# Altium project PowerMonitor.PrjPcb
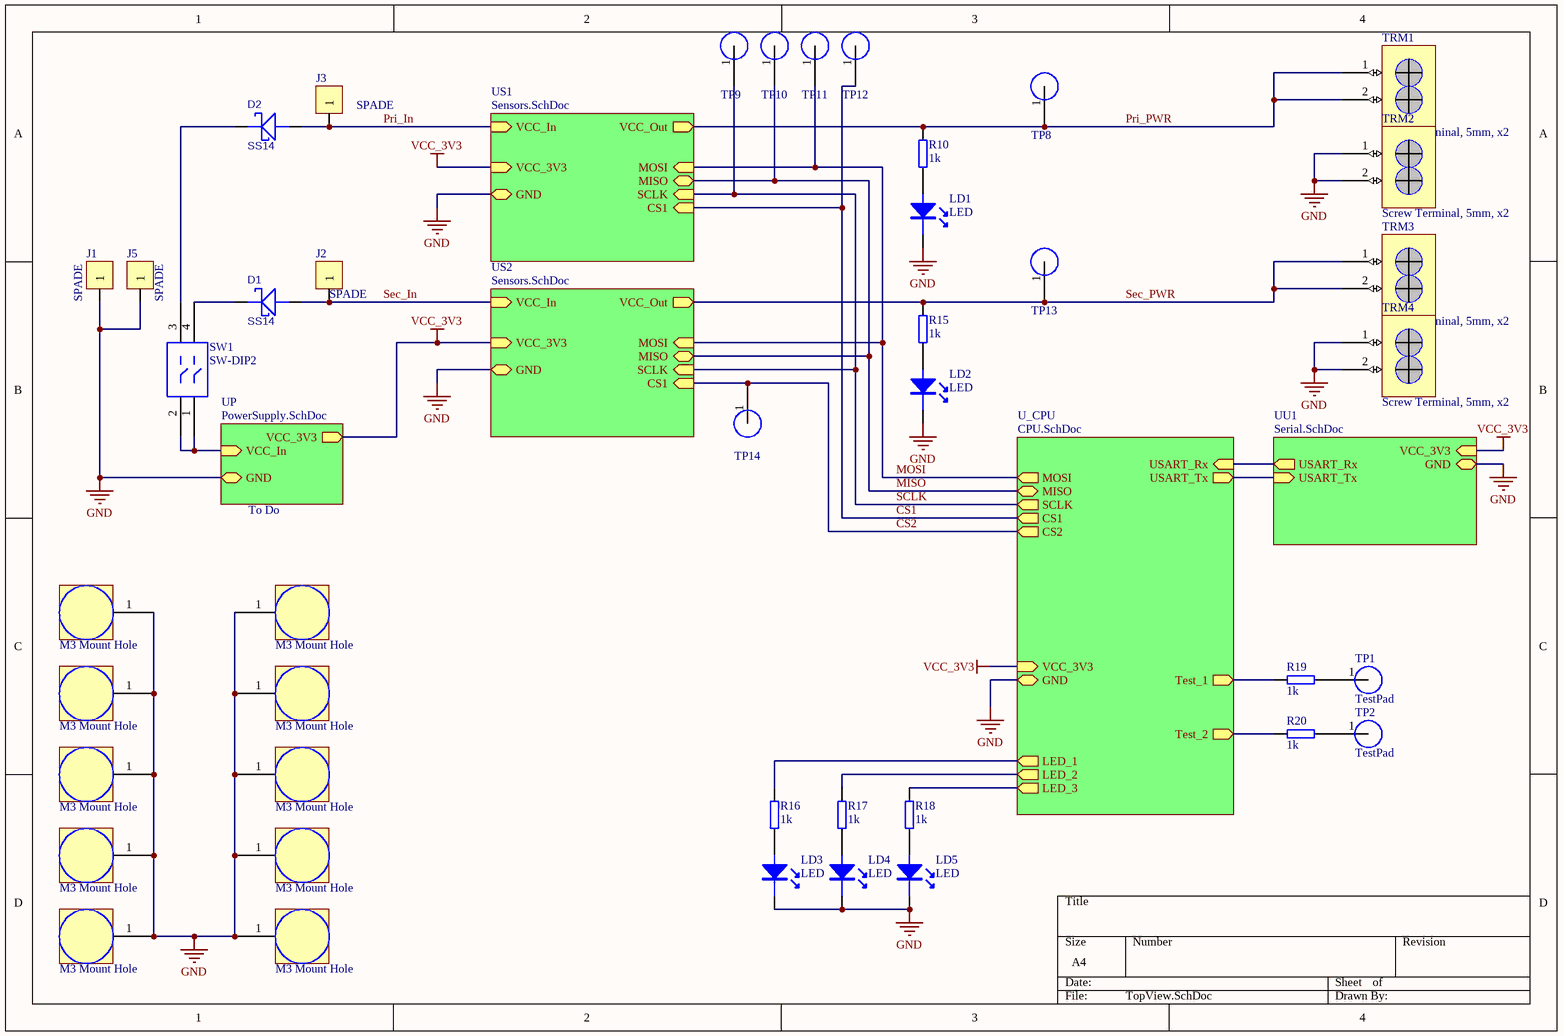
[diagram p0: TopView.SchDoc]
5 sheets, 138 parts. Net scope: hierarchical (ports join the sheet entries above them; power ports are global).
Board file: PowerMonito.PcbDoc
Sheets:
  TopView.SchDoc
    UP = PowerSupply.SchDoc
    US1 = Sensors.SchDoc
    US2 = Sensors.SchDoc
    UU1 = Serial.SchDoc
    U_CPU = CPU.SchDoc

## Sheet TopView.SchDoc
size A4

### Parts
D1  SS14  [DO-214AC]
D2  SS14  [DO-214AC]
J1  SPADE  [SPADE6.3-V]
J2  SPADE  [SPADE6.3-V]
J3  SPADE  [SPADE6.3-V]
J5  SPADE  [SPADE6.3-V]
LD1  LED  [LED3]
LD2  LED  [LED3]
LD3  LED  [LED3]
LD4  LED  [LED3]
LD5  LED  [LED3]
MNT1  M3 Mount Hole  [Mount_M3]
MNT2  M3 Mount Hole  [Mount_M3]
MNT3  M3 Mount Hole  [Mount_M3]
MNT4  M3 Mount Hole  [Mount_M3]
MNT5  M3 Mount Hole  [Mount_M3]
MNT6  M3 Mount Hole  [Mount_M3]
MNT7  M3 Mount Hole  [Mount_M3]
MNT8  M3 Mount Hole  [Mount_M3]
MNT9  M3 Mount Hole  [Mount_M3]
MNT10  M3 Mount Hole  [Mount_M3]
R10  1k  [0603]
R15  1k  [0603]
R16  1k  [0603]
R17  1k  [0603]
R18  1k  [0603]
R19  1k  [0603]
R20  1k  [0603]
SW1  SW-DIP2  [DIPSW2]
TP1  TestPad  [TestPad]
TP2  TestPad  [TestPad]
TP8  TestPad  [TestPad]  (value not drawn)
TP9  TestPad  [TestPad]  (value not drawn)
TP10  TestPad  [TestPad]  (value not drawn)
TP11  TestPad  [TestPad]  (value not drawn)
TP12  TestPad  [TestPad]  (value not drawn)
TP13  TestPad  [TestPad]  (value not drawn)
TP14  TestPad  [TestPad]  (value not drawn)
TRM1  Screw Terminal, 5mm, x2  [Terms5mm2]
TRM2  Screw Terminal, 5mm, x2  [Terms5mm2]
TRM3  Screw Terminal, 5mm, x2  [Terms5mm2]
TRM4  Screw Terminal, 5mm, x2  [Terms5mm2]

### Sub-sheets
U_CPU = CPU.SchDoc: GND (bidir), VCC_3V3 (in), MOSI (out), MISO (bidir), SCLK (out), CS1 (out), CS2 (out), LED_1 (out), LED_2 (out), LED_3 (out), Test_1 (out), Test_2 (out), USART_Tx (out), USART_Rx (in)
UP = PowerSupply.SchDoc: VCC_In (in), GND (bidir), VCC_3V3 (out)
US1 = Sensors.SchDoc: VCC_In (in), VCC_Out (out), VCC_3V3 (in), GND (bidir), MOSI (in), MISO (bidir), SCLK (in), CS1 (in)
US2 = Sensors.SchDoc: VCC_In (in), VCC_Out (out), VCC_3V3 (in), GND (bidir), MOSI (in), MISO (bidir), SCLK (in), CS1 (in)
UU1 = Serial.SchDoc: GND (bidir), VCC_3V3 (in), USART_Tx (in), USART_Rx (out)

### Nets
GND: J1.1 J5.1 LD1.K LD2.K LD3.K LD4.K LD5.K MNT1.1 MNT2.1 MNT3.1 MNT4.1 MNT5.1 MNT6.1 MNT7.1 MNT8.1 MNT9.1 MNT10.1 TRM2.1 TRM2.2 TRM4.1 TRM4.2 ; sheet UP/GND, sheet US1/GND, sheet US2/GND, sheet UU1/GND, sheet U_CPU/GND
VCC_3V3: sheet UP/VCC_3V3, sheet US1/VCC_3V3, sheet US2/VCC_3V3, sheet UU1/VCC_3V3, sheet U_CPU/VCC_3V3
CS1: TP12.1 ; sheet US1/CS1, sheet U_CPU/CS1
CS2: TP14.1 ; sheet US2/CS1, sheet U_CPU/CS2
MISO: TP10.1 ; sheet US1/MISO, sheet US2/MISO, sheet U_CPU/MISO
MOSI: TP11.1 ; sheet US1/MOSI, sheet US2/MOSI, sheet U_CPU/MOSI
Pri_In: D2.A J3.1 ; sheet US1/VCC_In
Pri_PWR: R10.2 TP8.1 TRM1.1 TRM1.2 ; sheet US1/VCC_Out
RXD0: sheet UU1/USART_Rx, sheet U_CPU/USART_Rx
SCLK: TP9.1 ; sheet US1/SCLK, sheet US2/SCLK, sheet U_CPU/SCLK
Sec_In: D1.A J2.1 ; sheet US2/VCC_In
Sec_PWR: R15.2 TP13.1 TRM3.1 TRM3.2 ; sheet US2/VCC_Out
TXD0: sheet UU1/USART_Tx, sheet U_CPU/USART_Tx
VIN: SW1.1 SW1.2 ; sheet UP/VCC_In
NetD1_K: D1.K SW1.4
NetD2_K: D2.K SW1.3
NetLD1_A: LD1.A R10.1
NetLD2_A: LD2.A R15.1
NetLD3_A: LD3.A R16.1
NetLD4_A: LD4.A R17.1
NetLD5_A: LD5.A R18.1
NetR16_2: R16.2 ; sheet U_CPU/LED_1
NetR17_2: R17.2 ; sheet U_CPU/LED_2
NetR18_2: R18.2 ; sheet U_CPU/LED_3
NetR19_1: R19.1 TP1.1
NetR19_2: R19.2 ; sheet U_CPU/Test_1
NetR20_1: R20.1 TP2.1
NetR20_2: R20.2 ; sheet U_CPU/Test_2

### Notes on the sheet
- To Do

### Library data of the parts
D1 D2 = DIODE SCHOTTKY
J1-J3 J5 = CON1
MNT1-MNT10 = M3_Mount: Supplier1: N/A; PartNo1: N/A; PartNo2: N/A; Supplier2: N/A
R10 R15-R20 = RES8
TP1 TP2 TP8-TP14 = TestPad: Test Pad; Supplier1: N/A; PartNo1: N/A; PartNo2: N/A; Supplier2: N/A
TRM1-TRM4 = ScrewTerms5mm2: PartNo1: P2034A; Rating: 20A, 300Vac; Supplier1: Altronics; PartNo2: -; Supplier2: -

## Sheet PowerSupply.SchDoc
size A4
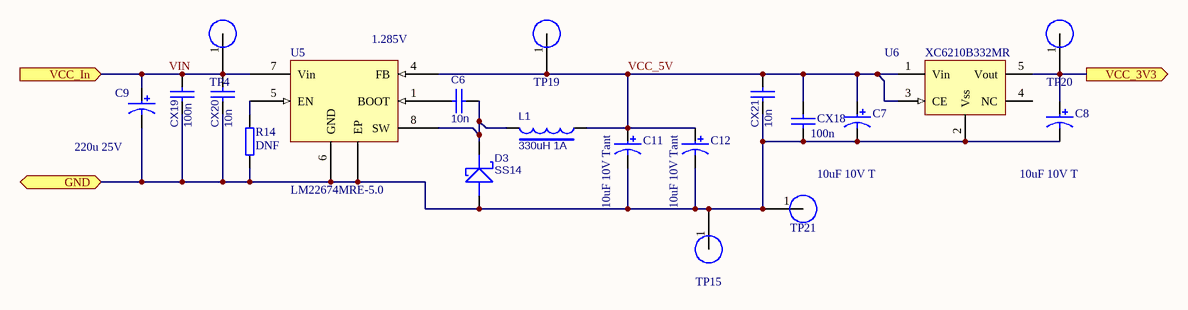
[diagram p1: PowerSupply.SchDoc]

### Parts
C6  10n  [0603]
C7  10uF 10V T  [SMD-TANT-A]
C8  10uF 10V T  [SMD-TANT-A]
C9  220u 25V  [RB.15/.32]
C11  10uF 10V Tant  [SMD-TANT-A]
C12  10uF 10V Tant  [SMD-TANT-A]
CX18  100n  [0603]
CX19  100n  [0603]
CX20  10n  [0603]
CX21  10n  [0603]
D3  SS14  [DO-214AC]
L1  330uH 1A  [INDUCTOR16]
R14  DNF  [0603]
TP4  TestPad  [TestPad]  (value not drawn)
TP15  TestPad  [TestPad]  (value not drawn)
TP19  TestPad  [TestPad]  (value not drawn)
TP20  TestPad  [TestPad]  (value not drawn)
TP21  TestPad  [TestPad]  (value not drawn)
U5  LM22674MRE-5.0  [PSOP-8]
U6  XC6210B332MR  [SOT-25-A]

### Ports
GND (bidir), VCC_3V3 (out), VCC_In (in)

### Nets
GND: C7.2 C8.2 C9.2 C11.2 C12.2 CX18.2 CX19.1 CX20.1 CX21.1 D3.A R14.1 TP15.1 TP21.1 U5.6(GND) U5.9(EP) U6.2(Vss) ; port GND
VCC_3V3: C8.1 TP20.1 U6.5(Vout) ; port VCC_3V3
VCC_5V: C7.1 C11.1 C12.1 CX18.1 CX21.2 L1.2 TP19.1 U5.4(FB) U6.1(Vin) U6.3(CE)
VIN: C9.1 CX19.2 CX20.2 TP4.1 U5.7(Vin) ; port VCC_In
NetC6_1: C6.1 U5.1(BOOT)
NetC6_2: C6.2 D3.K L1.1 U5.8(SW)
NetR14_2: R14.2 U5.5(EN)

Not connected (* = marked no-connect by the designer): U6 4(NC)

### Notes on the sheet
- (near U5) 1.285V

### Library data of the parts
C6 CX19-CX21 = CAP
C7-C9 C11 C12 = CAPACITOR POL-S
CX18 = cap
D3 = DIODE SCHOTTKY
L1 = INDUCTOR2: pin to pad: 2>0; Part Field 1: Electus LF-1402
R14 = RES8
TP4 TP15 TP19-TP21 = TestPad: Test Pad; Supplier1: N/A; PartNo1: N/A; PartNo2: N/A; Supplier2: N/A
U5 = LM22675: 0.5A SMPS, Fixed - 5V; PartNo1: LM22674MRE-5.0/NOPBCT-ND; Supplier1: DigiKey; PartNo2: 1679666RL; Supplier2: E14
U6 = XC6204B: 3.3 LDO; PartNo1: 893-1075-1-ND; Notes: 250mW Pd; Supplier1: Digi-Key; Supplier2: Element14; PartNo2: 1057803

## Sheet Sensors.SchDoc
size A4
Used 2 times, as channels US1, US2. Parts and nets are listed once, with the designators drawn on the sheet.
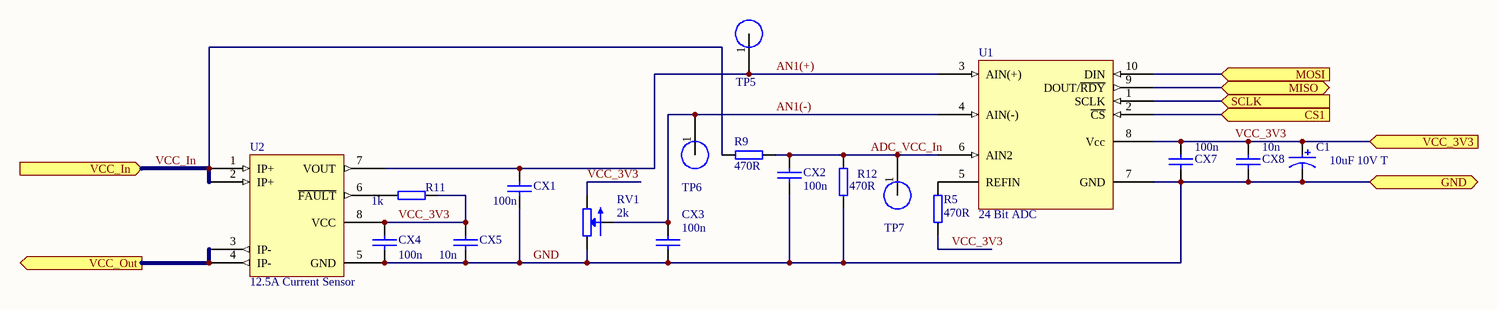
[diagram p2: Sensors.SchDoc]

### Parts
C1  10uF 10V T  [SMD-TANT-A]
CX1  100n  [0603]
CX2  100n  [0603]
CX3  100n  [0603]
CX4  100n  [0603]
CX5  10n  [0603]
CX7  100n  [0603]
CX8  10n  [0603]
R5  470R  [0603]
R9  470R  [0603]
R11  1k  [0603]
R12  470R  [0603]
RV1  2k  [VR3362P]
TP5  TestPad  [TestPad]  (value not drawn)
TP6  TestPad  [TestPad]  (value not drawn)
TP7  TestPad  [TestPad]  (value not drawn)
U1  24 Bit ADC  [MSOP-UN10_L]
U2  12.5A Current Sensor  [SO-8]

### Ports
CS1 (in), GND (bidir), MISO (bidir), MOSI (in), SCLK (in), VCC_3V3 (in), VCC_In (in), VCC_Out (out)

### Nets
ADC_VCC_In: CX2.1 R9.1 R12.2 TP7.1 U1.6(AIN2)
AN1(+): CX1.2 TP5.1 U1.3(AIN(+)) U2.7(VOUT)
AN1(-): CX3.2 RV1.W TP6.1 U1.4(AIN(-))
CS1: U1.2(~{CS}) ; port CS1
GND: C1.2 CX1.1 CX2.2 CX3.1 CX4.1 CX5.1 CX7.1 CX8.1 R12.1 RV1.CCW U1.7(GND) U2.5(GND) ; port GND
MISO: U1.9(DOUT/~{RDY}) ; port MISO
MOSI: U1.10(DIN) ; port MOSI
SCLK: U1.1(SCLK) ; port SCLK
VCC_3V3: C1.1 CX4.2 CX5.2 CX7.2 CX8.2 R5.2 R11.1 RV1.CW U1.8(Vcc) U2.8(VCC) ; port VCC_3V3
VCC_In: R9.2 U2.1(IP+) U2.2(IP+) ; port VCC_In
VCC_Out: U2.3(IP-) U2.4(IP-) ; port VCC_Out
NetR5_1: R5.1 U1.5(REFIN)
NetR11_2: R11.2 U2.6(~{FAULT})

### Channels
US1: designators end in _US1; ports CS1=CS1 GND=GND MISO=MISO MOSI=MOSI SCLK=SCLK VCC_3V3=VCC_3V3 VCC_In=Pri_In VCC_Out=Pri_PWR
US2: designators end in _US2; ports CS1=CS2 GND=GND MISO=MISO MOSI=MOSI SCLK=SCLK VCC_3V3=VCC_3V3 VCC_In=Sec_In VCC_Out=Sec_PWR

### Library data of the parts
C1 = CAPACITOR POL-S
CX1 CX3-CX5 CX7 CX8 = CAP
CX2 = Cap
R5 R9 R11 R12 = res8
RV1 = RES6
TP5-TP7 = TestPad: Test Pad; Supplier1: N/A; PartNo1: N/A; PartNo2: N/A; Supplier2: N/A
U1 = AD7787BRMZ 24Bit ADC: AD7787BRMZ IC, 24BIT ADC, SMD, 7787, MSOP10; PartNo1: AD7787BRMZ-ND; Supplier2: E14; PartNo2: 1581940; Supplier1: Digi-Key
U2 = ACS711_12.5A_Current: ACS711; PartNo1: 620-1370-1-ND; PartNo2: 2057423; Supplier2: E14; Supplier1: Digi-Key

## Sheet Serial.SchDoc
size A4
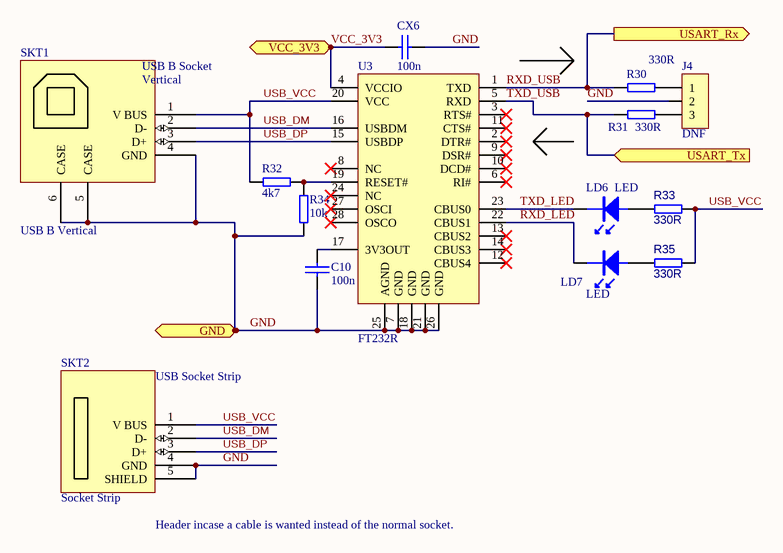
[diagram p3: Serial.SchDoc]

### Parts
C10  100n  [0603]
CX6  100n  [0603]
J4  DNF  [sip3]
LD6  LED  [LED3]
LD7  LED  [LED3]
R30  330R  [0603]
R31  330R  [0603]
R32  4k7  [0603]
R33  330R  [0603]
R34  10k  [0603]
R35  330R  [0603]
SKT1  USB B Vertical  [USB_B_Vertical]
SKT2  Socket Strip  [USB_SocketStrip]
U3  FT232R  [ssop28]

### Ports
GND (bidir), USART_Rx (out), USART_Tx (in), VCC_3V3 (in)

### Nets
GND: C10.1 CX6.1 J4.2 R34.1 SKT1.4(GND) SKT1.5(CASE) SKT1.6(CASE) SKT2.4(GND) SKT2.5(SHIELD) U3.7(GND) U3.18(GND) U3.21(GND) U3.25(AGND) U3.26(GND) ; port GND
VCC_3V3: CX6.2 U3.4(VCCIO) ; port VCC_3V3
RXD_LED: LD7.K U3.22(CBUS1)
RXD_USB: R30.2 U3.1(TXD) ; port USART_Rx  [project net RXD0]
TXD_LED: LD6.K U3.23(CBUS0)
TXD_USB: R31.2 U3.5(RXD) ; port USART_Tx  [project net TXD0]
USB_DM: SKT1.2(D-) SKT2.2(D-) U3.16(USBDM)
USB_DP: SKT1.3(D+) SKT2.3(D+) U3.15(USBDP)
USB_VCC: R32.1 R33.1 R35.1 SKT1.1(V_BUS) SKT2.1(V_BUS) U3.20(VCC)
NetC10_2: C10.2 U3.17(3V3OUT)
NetJ4_1: J4.1 R30.1
NetJ4_3: J4.3 R31.1
NetLD6_A: LD6.A R33.2
NetLD7_A: LD7.A R35.2
NetR32_2: R32.2 R34.2 U3.19(RESET#)

Not connected (* = marked no-connect by the designer): U3 2(DTR#)* 3(RTS#)* 6(RI#)* 8(NC)* 9(DSR#)* 10(DCD#)* 11(CTS#)* 12(CBUS4)* 13(CBUS2)* 14(CBUS3)* 24(NC)* 27(OSCI)* 28(OSCO)*

### Notes on the sheet
- (near SKT2) Header incase a cable is wanted instead of the normal socket.
- (in symbol USB_B_Vertical) USB B Socket; Vertical
- (in symbol USB_Pins) USB Socket Strip

### Library data of the parts
C10 CX6 = CAP
J4 = con3
R30 R31 = res8
R32-R35 = RES8
SKT1 = USB_B_Vertical: PartNo1: 732-2734-ND; Supplier1: Digi-Key; PartNo2: -; Supplier2: -
SKT2 = USB_Pins: Supplier1: N/A; Supplier2: N/A; PartNo1: N/A; PartNo2: N/A

## Sheet CPU.SchDoc
size A4
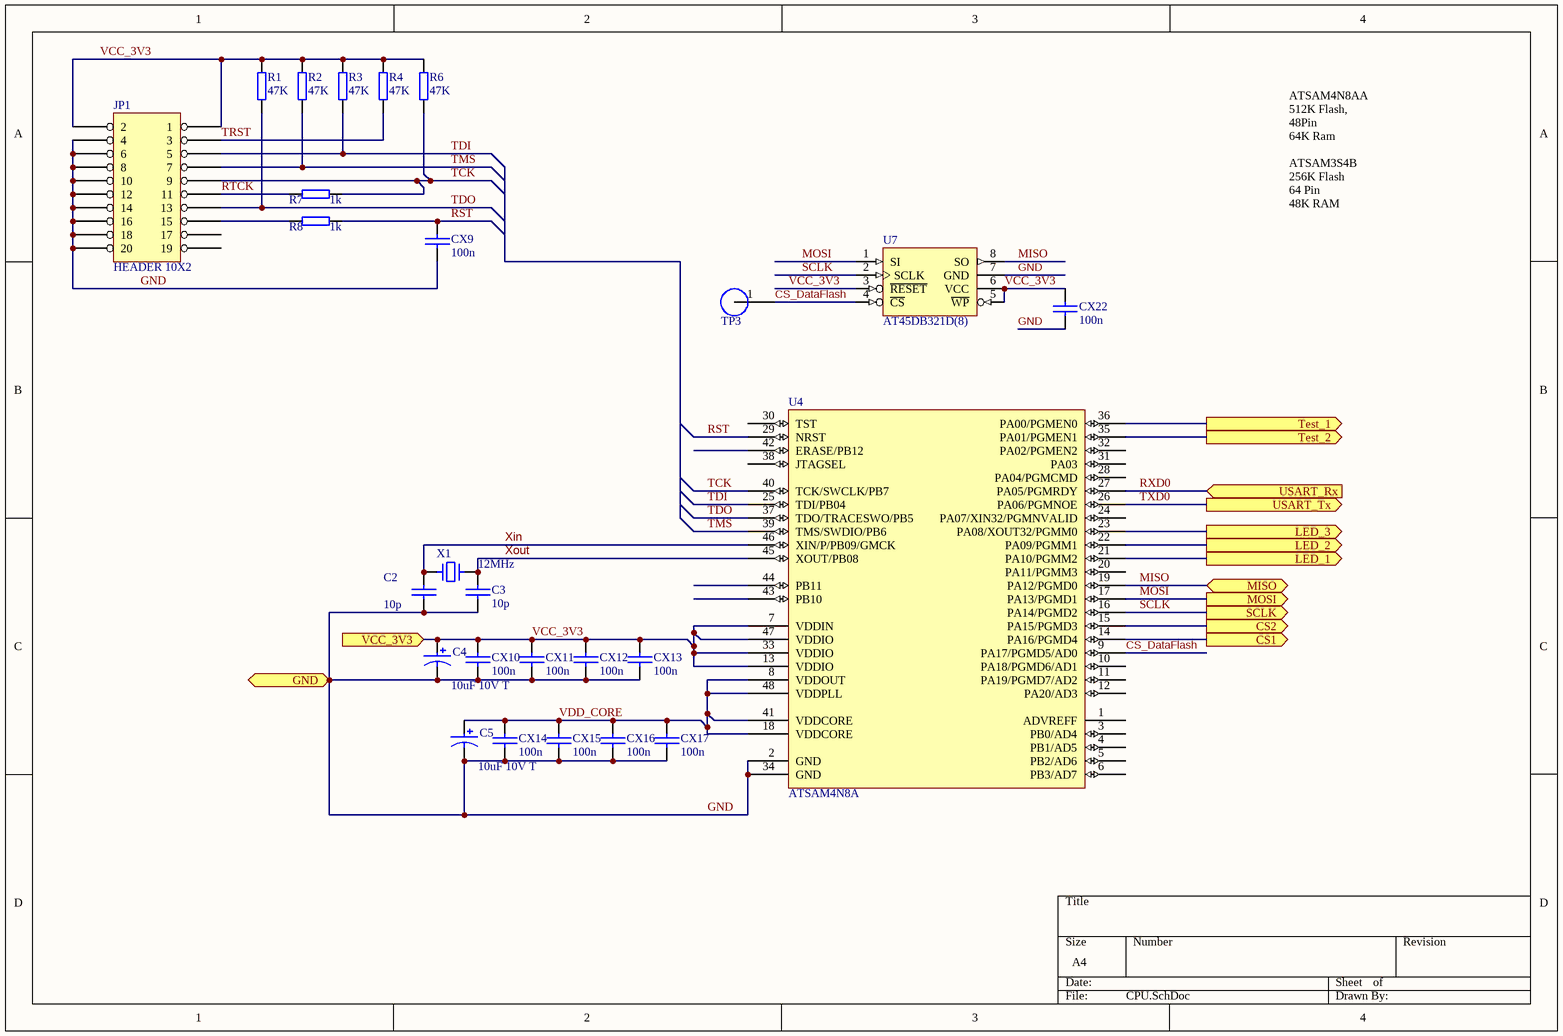
[diagram p4: CPU.SchDoc]

### Parts
C2  10p  [0603]
C3  10p  [0603]
C4  10uF 10V T  [SMD-TANT-A]
C5  10uF 10V T  [SMD-TANT-A]
CX9  100n  [0603]
CX10  100n  [0603]
CX11  100n  [0603]
CX12  100n  [0603]
CX13  100n  [0603]
CX14  100n  [0603]
CX15  100n  [0603]
CX16  100n  [0603]
CX17  100n  [0603]
CX22  100n  [0603]
JP1  HEADER 10X2  [IDC20BOX]
R1  47K  [0603]
R2  47K  [0603]
R3  47K  [0603]
R4  47K  [0603]
R6  47K  [0603]
R7  1k  [0603]
R8  1k  [0603]
TP3  TestPad  [TestPad]  (value not drawn)
U4  ATSAM4N8A  [48A_M]
U7  AT45DB321D(8)  [SO-8W-MLF]
X1  12MHz  [XTAL-V2]

### Ports
CS1 (out), CS2 (out), GND (bidir), LED_1 (out), LED_2 (out), LED_3 (out), MISO (bidir), MOSI (out), SCLK (out), Test_1 (out), Test_2 (out), USART_Rx (in), USART_Tx (out), VCC_3V3 (in)

### Nets
GND: C2.2 C3.2 C4.2 C5.2 CX9.1 CX10.1 CX11.1 CX12.1 CX13.1 CX14.1 CX15.1 CX16.1 CX17.1 CX22.1 JP1.4 JP1.6 JP1.8 JP1.10 JP1.12 JP1.14 JP1.16 JP1.18 JP1.20 U4.2(GND) U4.34(GND) U7.7(GND) ; port GND
VCC_3V3: C4.1 CX10.2 CX11.2 CX12.2 CX13.2 CX22.2 JP1.1 JP1.2 R1.2 R2.2 R3.2 R4.2 R6.2 U4.7(VDDIN) U4.13(VDDIO) U4.33(VDDIO) U4.47(VDDIO) U7.3(~{RESET}) U7.5(~{WP}) U7.6(VCC) ; port VCC_3V3
CS1: U4.14(PA16/PGMD4) ; port CS1
CS2: U4.15(PA15/PGMD3) ; port CS2
CS_DataFlash: TP3.1 U4.9(PA17/PGMD5/AD0) U7.4(~{CS})
MISO: U4.19(PA12/PGMD0) U7.8(SO) ; port MISO
MOSI: U4.17(PA13/PGMD1) U7.1(SI) ; port MOSI
RST: CX9.2 R8.2 U4.29(NRST)
RTCK: JP1.11 R7.1
RXD0: U4.27(PA05/PGMRDY) ; port USART_Rx
SCLK: U4.16(PA14/PGMD2) U7.2(SCLK) ; port SCLK
TCK: JP1.9 R6.1 R7.2 U4.40(TCK/SWCLK/PB7)
TDI: JP1.5 R3.1 U4.25(TDI/PB04)
TDO: JP1.13 R1.1 U4.37(TDO/TRACESWO/PB5)
TMS: JP1.7 R2.1 U4.39(TMS/SWDIO/PB6)
TRST: JP1.3 R4.1
TXD0: U4.26(PA06/PGMNOE) ; port USART_Tx
VDD_CORE: C5.1 CX14.2 CX15.2 CX16.2 CX17.2 U4.8(VDDOUT) U4.18(VDDCORE) U4.41(VDDCORE) U4.48(VDDPLL)
Xin: C2.1 U4.46(XIN/P/PB09/GMCK) X1.2
Xout: C3.1 U4.45(XOUT/PB08) X1.1
NetJP1_15: JP1.15 R8.1
NetR16_2: U4.21(PA10/PGMM2) ; port LED_1
NetR17_2: U4.22(PA09/PGMM1) ; port LED_2
NetR18_2: U4.23(PA08/XOUT32/PGMM0) ; port LED_3
NetR19_2: U4.36(PA00/PGMEN0) ; port Test_1
NetR20_2: U4.35(PA01/PGMEN1) ; port Test_2

Not connected (* = marked no-connect by the designer): JP1 17 19; U4 1(ADVREFF) 3(PB0/AD4) 4(PB1/AD5) 5(PB2/AD6) 6(PB3/AD7) 10(PA18/PGMD6/AD1) 11(PA19/PGMD7/AD2) 12(PA20/AD3) 20(PA11/PGMM3) 24(PA07/XIN32/PGMNVALID) 28(PA04/PGMCMD) 30(TST) 31(PA03) 32(PA02/PGMEN2) 38(JTAGSEL) 42(ERASE/PB12) 43(PB10) 44(PB11)

### Notes on the sheet
- ATSAM4N8AA
  512K Flash,
  48Pin
  64K Ram
  ATSAM3S4B
  256K Flash
  64 Pin
  48K RAM

### Library data of the parts
C2 C3 = cap
C4 C5 = CAPACITOR POL-S
CX9-CX17 CX22 = CAP
R1-R4 R6-R8 = RES8
TP3 = TestPad: Test Pad; Supplier1: N/A; PartNo1: N/A; PartNo2: N/A; Supplier2: N/A
U4 = ATSAM4N8A: Cortex-M4, 100MHz, 512K Flash, 64K SRAM; PartNo1: ATSAM4N8AA-AURCT-ND; PartNo2: 2355223; Supplier2: Element14; Supplier1: Digi-Key
U7 = AT45DB041(8)
X1 = CRYSTAL

## Nets that join several sheets
GND: TopView (21 pins), PowerSupply (16 pins), US1 (12 pins), US2 (12 pins), Serial (14 pins), CPU (26 pins)
VCC_3V3: PowerSupply (C8.1 TP20.1 U6.5), US1 (10 pins), US2 (10 pins), Serial (CX6.2 U3.4), CPU (20 pins)
CS1: TopView (TP12.1), US1 (U1_US1.2), CPU (U4.14)
CS2: TopView (TP14.1), US2 (U1_US2.2), CPU (U4.15)
MISO: TopView (TP10.1), US1 (U1_US1.9), US2 (U1_US2.9), CPU (U4.19 U7.8)
MOSI: TopView (TP11.1), US1 (U1_US1.10), US2 (U1_US2.10), CPU (U4.17 U7.1)
NetR16_2: TopView (R16.2), CPU (U4.21)
NetR17_2: TopView (R17.2), CPU (U4.22)
NetR18_2: TopView (R18.2), CPU (U4.23)
NetR19_2: TopView (R19.2), CPU (U4.36)
NetR20_2: TopView (R20.2), CPU (U4.35)
Pri_In: TopView (D2.A J3.1), US1 (R9_US1.2 U2_US1.1 U2_US1.2)
Pri_PWR: TopView (R10.2 TP8.1 TRM1.1 TRM1.2), US1 (U2_US1.3 U2_US1.4)
RXD0: Serial (R30.2 U3.1), CPU (U4.27)
SCLK: TopView (TP9.1), US1 (U1_US1.1), US2 (U1_US2.1), CPU (U4.16 U7.2)
Sec_In: TopView (D1.A J2.1), US2 (R9_US2.2 U2_US2.1 U2_US2.2)
Sec_PWR: TopView (R15.2 TP13.1 TRM3.1 TRM3.2), US2 (U2_US2.3 U2_US2.4)
TXD0: Serial (R31.2 U3.5), CPU (U4.26)
VIN: TopView (SW1.1 SW1.2), PowerSupply (5 pins)